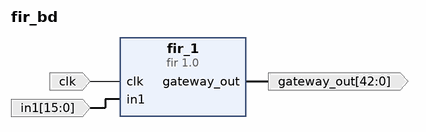
[diagram p0: block diagram of the top level]
# Vivado block design fir_bd, xc7k325tfbg676-3, Vivado 2018.3
create_bd_design fir_bd

create_bd_port -dir I -type clk clk
create_bd_port -dir O -from 42 -to 0 -type data gateway_out
create_bd_port -dir I -from 15 -to 0 -type data in1

create_bd_cell -type ip -vlnv User_Company:SysGen:fir:1.0 fir_1

# ---- connections ----

connect_bd_net [get_bd_ports clk] [get_bd_pins fir_1/clk]
connect_bd_net [get_bd_pins fir_1/gateway_out] [get_bd_ports gateway_out]
connect_bd_net -net in1_1 [get_bd_ports in1] [get_bd_pins fir_1/in1]

validate_bd_design
save_bd_design
